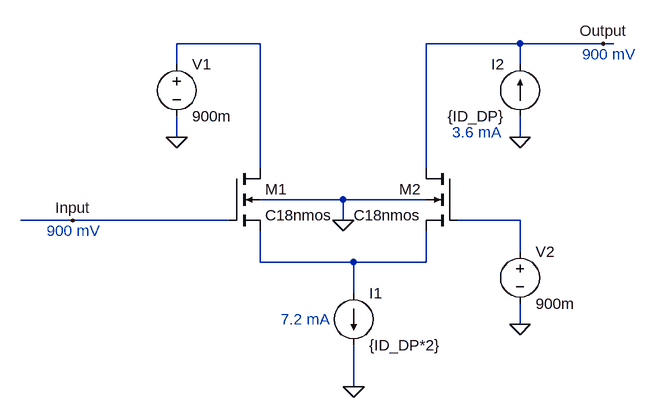
[diagram p0: schematic Draft1.asc]
Draft1.asc, the LTspice schematic file:
Version 4
SHEET 1 880 680
WIRE 0 -128 -128 -128
WIRE 400 -128 256 -128
WIRE 528 -128 400 -128
WIRE 544 -128 528 -128
WIRE -128 -96 -128 -128
WIRE 400 -96 400 -128
WIRE -128 16 -128 -16
WIRE 400 16 400 -16
WIRE 0 64 0 -128
WIRE 256 64 256 -128
WIRE 128 112 0 112
WIRE 256 112 128 112
WIRE -288 144 -368 144
WIRE -48 144 -288 144
WIRE 128 144 128 112
WIRE 400 144 304 144
WIRE 400 192 400 144
WIRE 0 208 0 160
WIRE 144 208 0 208
WIRE 256 208 256 160
WIRE 256 208 144 208
WIRE 144 256 144 208
WIRE 400 304 400 272
WIRE 144 400 144 336
FLAG 144 400 0
FLAG -288 144 Input
FLAG 528 -128 Output
FLAG 128 144 0
FLAG -128 16 0
FLAG 400 304 0
FLAG 400 16 0
SYMBOL current 144 256 R0
WINDOW 123 0 0 Left 0
WINDOW 39 0 0 Left 0
SYMATTR InstName I1
SYMATTR Value {ID_DP*2}
SYMBOL nmos4 -48 64 R0
SYMATTR InstName M1
SYMATTR Value C18nmos
SYMATTR Value2 l={L_DP} w={W_DP}
SYMBOL nmos4 304 64 M0
SYMATTR InstName M2
SYMATTR Value C18nmos
SYMATTR Value2 l={L_DP} w={W_DP}
SYMBOL voltage -128 -112 R0
SYMATTR InstName V1
SYMATTR Value 900m
SYMBOL voltage 400 176 R0
SYMATTR InstName V2
SYMATTR Value 900m
SYMBOL current 400 -16 R180
WINDOW 0 24 80 Left 2
WINDOW 3 24 0 Left 2
SYMATTR InstName I2
SYMATTR Value {ID_DP}
TEXT -328 160 Left 2 ;900 mV
TEXT 496 -112 Left 2 ;900 mV
TEXT 32 296 Left 2 ;7.2 mA
TEXT 296 8 Left 2 ;3.6 mA

The netlist it stands for:
* Draft1.asc
I1 N003 0 {ID_DP*2}
M1 N001 Input N003 0 C18nmos l={L_DP} w={W_DP}
M2 Output N002 N003 0 C18nmos l={L_DP} w={W_DP}
V1 N001 0 900m
V2 N002 0 900m
I2 0 Output {ID_DP}
.model NMOS NMOS
.model PMOS PMOS
.lib standard.mos
* 900 mV
* 900 mV
* 7.2 mA
* 3.6 mA
.backanno
.end